# Altium schematic sheet Stepper_driver_group.SchDoc: STM32F412 CNC
size C; Author: AM; CompanyName: Expatria Technologies; DrawnBy: A.Marles; Engineer: AM; Organization: Expatria Technolgoies; Address1: PO Box 2084; Address3: Merritt, BC V1K 1B8; Address4: Canada; DocumentNumber: 8; SheetNumber: 8; SheetTotal: 27
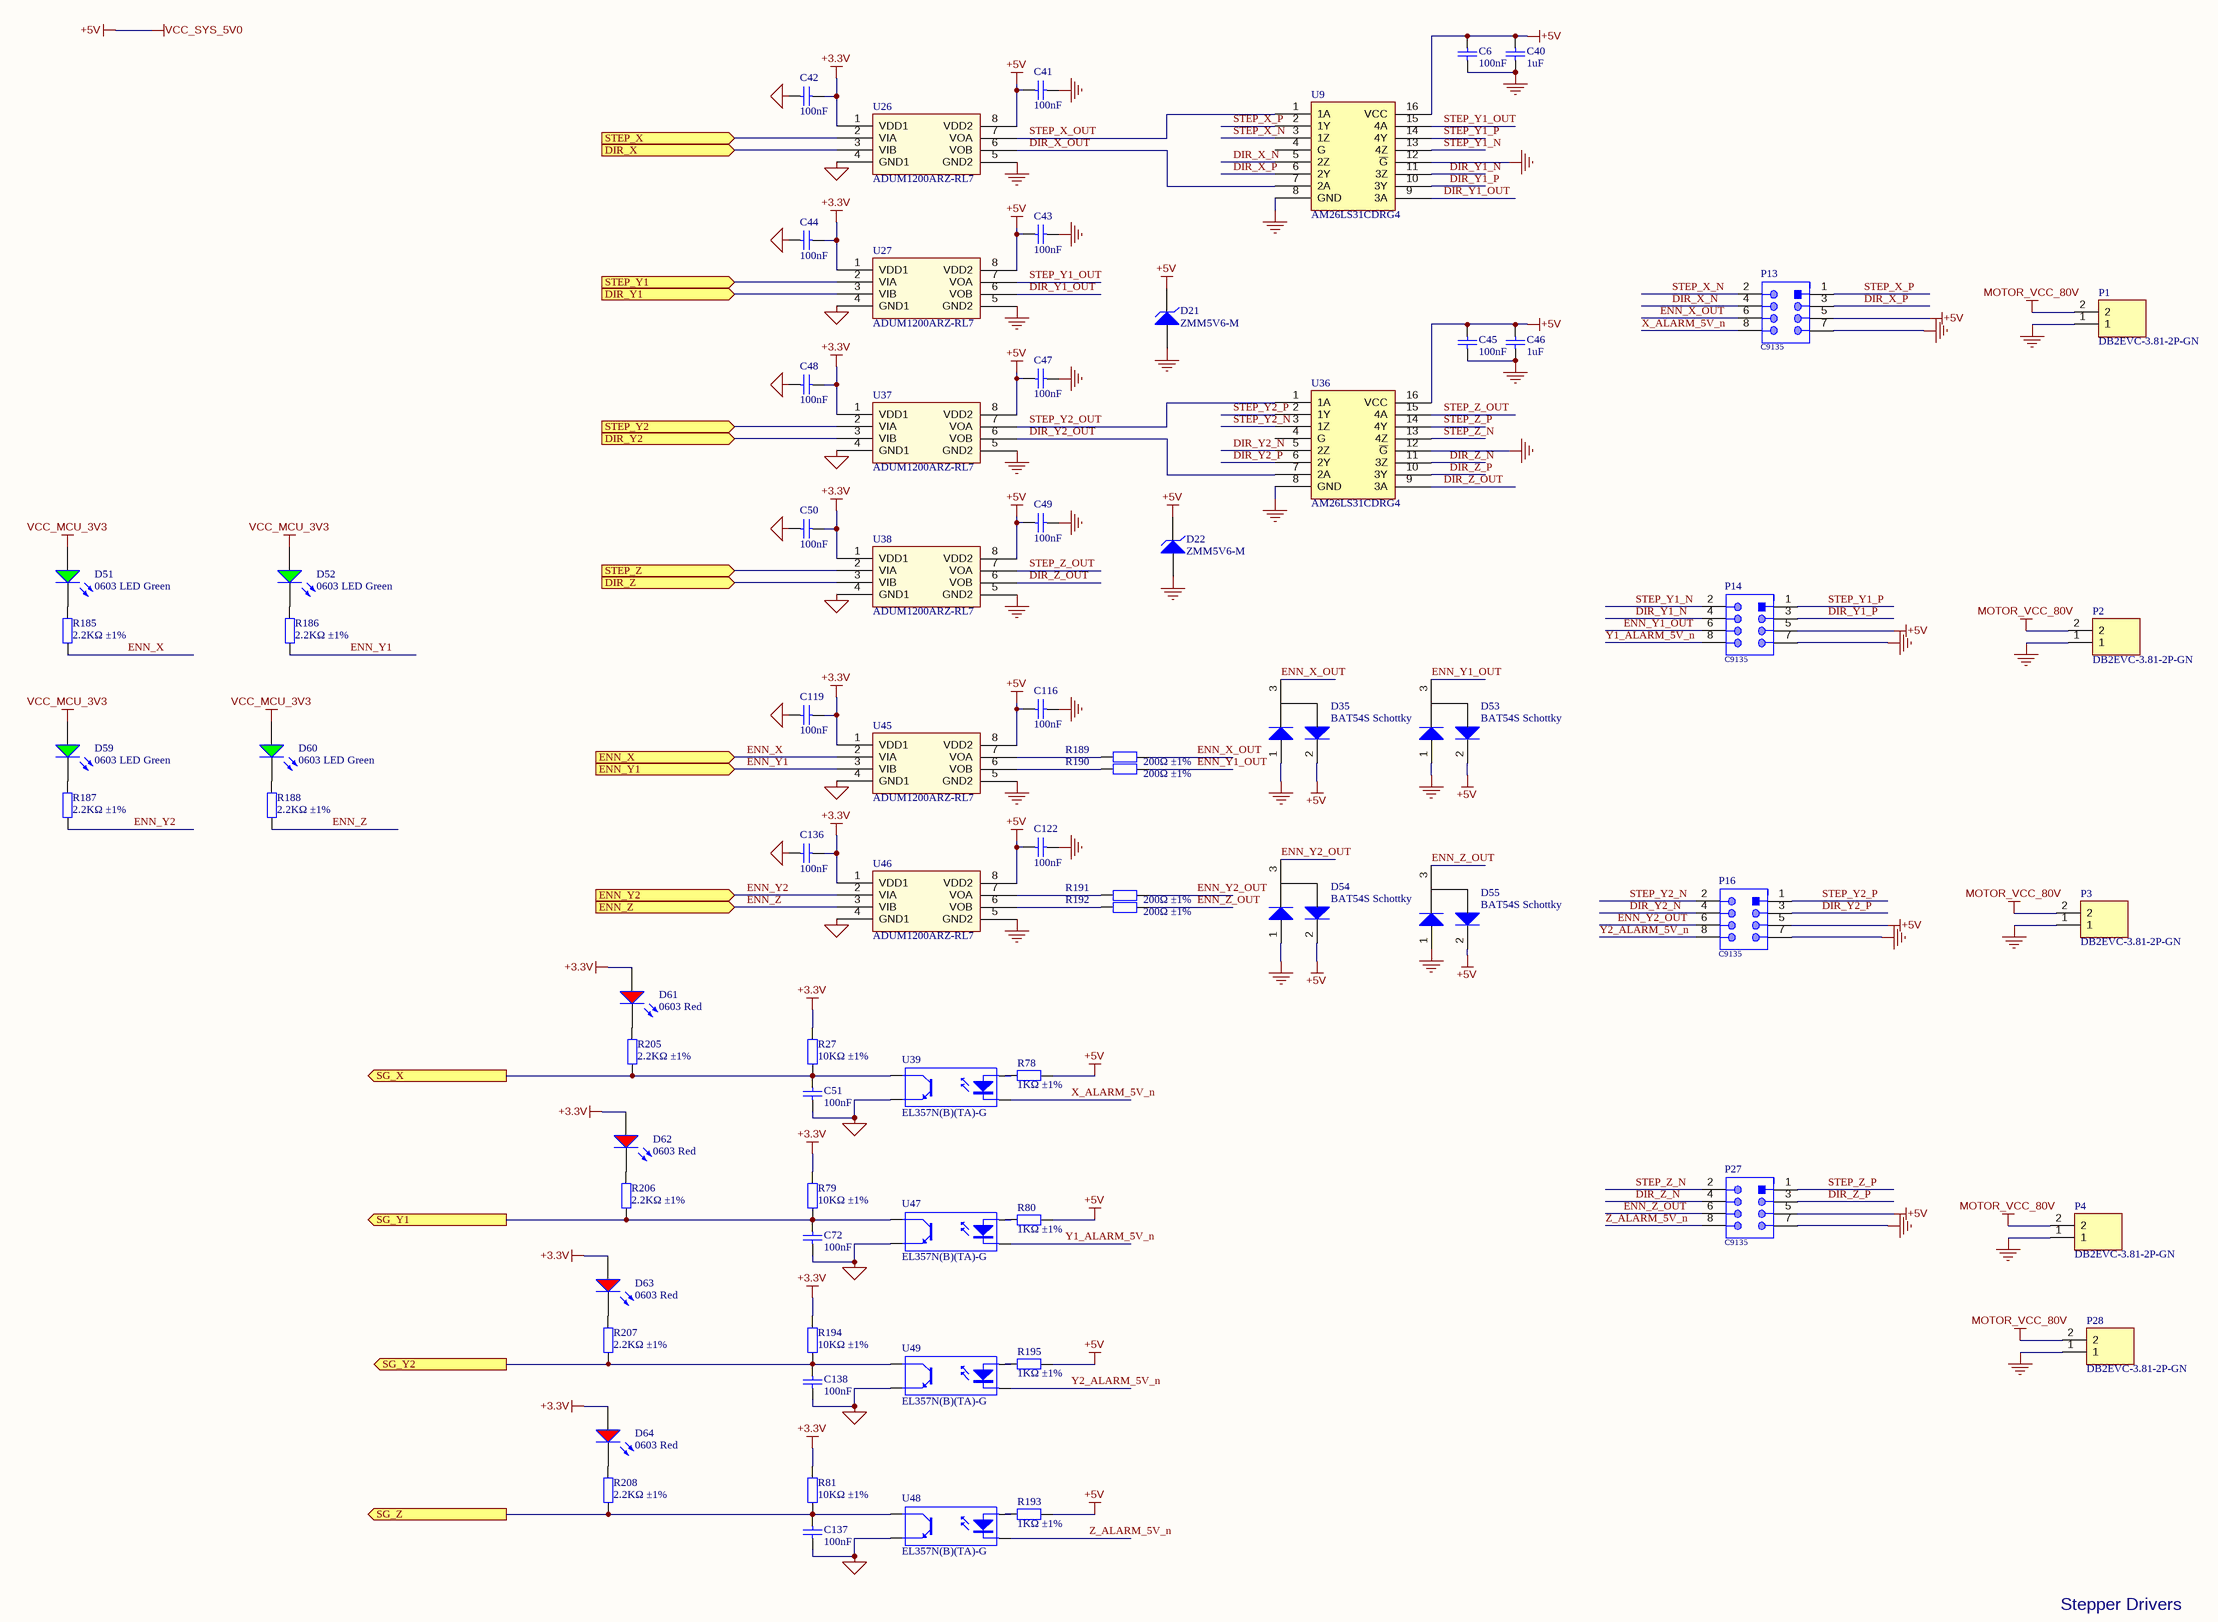
[diagram p0: Stepper_driver_group.SchDoc]

## Parts
C6  100nF  [0603_C]
C40  1uF  [0603_C]
C41  100nF  [0603_C]
C42  100nF  [0603_C]
C43  100nF  [0603_C]
C44  100nF  [0603_C]
C45  100nF  [0603_C]
C46  1uF  [0603_C]
C47  100nF  [0603_C]
C48  100nF  [0603_C]
C49  100nF  [0603_C]
C50  100nF  [0603_C]
C51  100nF  [0402_C]
C72  100nF  [0402_C]
C116  100nF  [0603_C]
C119  100nF  [0603_C]
C122  100nF  [0603_C]
C136  100nF  [0603_C]
C137  100nF  [0402_C]
C138  100nF  [0402_C]
D21  ZMM5V6-M  [LL-34]
D22  ZMM5V6-M  [LL-34]
D35  BAT54S Schottky  [SOT-23(SOT-23-3)]
D51  0603 LED Green  [0603_LED_S1 - GREEN]
D52  0603 LED Green  [0603_LED_S1 - GREEN]
D53  BAT54S Schottky  [SOT-23(SOT-23-3)]
D54  BAT54S Schottky  [SOT-23(SOT-23-3)]
D55  BAT54S Schottky  [SOT-23(SOT-23-3)]
D59  0603 LED Green  [0603_LED_S1 - GREEN]
D60  0603 LED Green  [0603_LED_S1 - GREEN]
D61  0603 Red  [0603_LED_S1]
D62  0603 Red  [0603_LED_S1]
D63  0603 Red  [0603_LED_S1]
D64  0603 Red  [0603_LED_S1]
P1  DB2EVC-3.81-2P-GN  [CONN-TH_5P-P3.81_DB2EVC-3.81-2p]
P2  DB2EVC-3.81-2P-GN  [CONN-TH_5P-P3.81_DB2EVC-3.81-2p]
P3  DB2EVC-3.81-2P-GN  [CONN-TH_5P-P3.81_DB2EVC-3.81-2p]
P4  DB2EVC-3.81-2P-GN  [CONN-TH_5P-P3.81_DB2EVC-3.81-2p]
P13  C9135  [61200821621]
P14  C9135  [61200821621]
P16  C9135  [61200821621]
P27  C9135  [61200821621]
P28  DB2EVC-3.81-2P-GN  [CONN-TH_5P-P3.81_DB2EVC-3.81-2p]
R27  10KΩ ±1%  [0402_R]
R78  1KΩ ±1%  [0603_R]
R79  10KΩ ±1%  [0402_R]
R80  1KΩ ±1%  [0603_R]
R81  10KΩ ±1%  [0402_R]
R185  2.2KΩ ±1%  [0402_R]
R186  2.2KΩ ±1%  [0402_R]
R187  2.2KΩ ±1%  [0402_R]
R188  2.2KΩ ±1%  [0402_R]
R189  200Ω ±1%  [0603_R]
R190  200Ω ±1%  [0603_R]
R191  200Ω ±1%  [0603_R]
R192  200Ω ±1%  [0603_R]
R193  1KΩ ±1%  [0603_R]
R194  10KΩ ±1%  [0402_R]
R195  1KΩ ±1%  [0603_R]
R205  2.2KΩ ±1%  [0402_R]
R206  2.2KΩ ±1%  [0402_R]
R207  2.2KΩ ±1%  [0402_R]
R208  2.2KΩ ±1%  [0402_R]
U9  AM26LS31CDRG4  [SOIC-16_150mil]
U26  ADUM1200ARZ-RL7  [SOIC-8_150mil]
U27  ADUM1200ARZ-RL7  [SOIC-8_150mil]
U36  AM26LS31CDRG4  [SOIC-16_150mil]
U37  ADUM1200ARZ-RL7  [SOIC-8_150mil]
U38  ADUM1200ARZ-RL7  [SOIC-8_150mil]
U39  EL357N(B)(TA)-G  [SOP-4_P2.54]
U45  ADUM1200ARZ-RL7  [SOIC-8_150mil]
U46  ADUM1200ARZ-RL7  [SOIC-8_150mil]
U47  EL357N(B)(TA)-G  [SOP-4_P2.54]
U48  EL357N(B)(TA)-G  [SOP-4_P2.54]
U49  EL357N(B)(TA)-G  [SOP-4_P2.54]

## Ports
DIR_X (in), DIR_Y1 (in), DIR_Y2 (in), DIR_Z (in), ENN_X (in), ENN_Y1 (in), ENN_Y2 (in), ENN_Z (in), SG_X (out), SG_Y1 (out), SG_Y2 (out), SG_Z (out), STEP_X (in), STEP_Y1 (in), STEP_Y2 (in), STEP_Z (in)

## Nets
+3.3V: C42.1 C44.1 C48.1 C50.1 C119.1 C136.1 D61.A D62.A D63.A D64.A R27.2 R79.2 R81.2 R194.2 U26.1(VDD1) U27.1(VDD1) U37.1(VDD1) U38.1(VDD1) U45.1(VDD1) U46.1(VDD1)
+5V: C6.1 C40.1 C41.2 C43.2 C45.1 C46.1 C47.2 C49.2 C116.2 C122.2 D21.2(K) D22.2(K) D35.2(A) D53.2(A) D54.2(A) D55.2(A) P13.5 P14.5 P16.5 P27.5 R78.1 R80.1 R193.1 R195.1 U9.16(VCC) U26.8(VDD2) U27.8(VDD2) U36.16(VCC) U37.8(VDD2) U38.8(VDD2) U45.8(VDD2) U46.8(VDD2)  [also labelled VCC_SYS_5V0]
GND: C6.2 C40.2 C41.1 C43.1 C45.2 C46.2 C47.1 C49.1 C116.1 C122.1 D21.1(A) D22.1(A) D35.1(A) D53.1(A) D54.1(A) D55.1(A) P1.1 P2.1 P3.1 P4.1 P13.7 P14.7 P16.7 P27.7 P28.1 U9.8(GND) U9.12(~{G}) U26.5(GND2) U27.5(GND2) U36.8(GND) U36.12(~{G}) U37.5(GND2) U38.5(GND2) U45.5(GND2) U46.5(GND2)
MCU_GND: C42.2 C44.2 C48.2 C50.2 C51.1 C72.1 C119.2 C136.2 C137.1 C138.1 U26.4(GND1) U27.4(GND1) U37.4(GND1) U38.4(GND1) U39.3(E) U45.4(GND1) U46.4(GND1) U47.3(E) U48.3(E) U49.3(E)
MOTOR_VCC_80V: P1.2 P2.2 P3.2 P4.2 P28.2
VCC_MCU_3V3: D51.A D52.A D59.A D60.A
DIR_X: U26.3(VIB) ; port DIR_X
DIR_X_N: P13.4 U9.5(2Z)
DIR_X_OUT: U9.7(2A) U26.6(VOB)
DIR_X_P: P13.3 U9.6(2Y)
DIR_Y1: U27.3(VIB) ; port DIR_Y1
DIR_Y1_N: P14.4 U9.11(3Z)
DIR_Y1_OUT: U9.9(3A) U27.6(VOB)
DIR_Y1_P: P14.3 U9.10(3Y)
DIR_Y2: U37.3(VIB) ; port DIR_Y2
DIR_Y2_N: P16.4 U36.5(2Z)
DIR_Y2_OUT: U36.7(2A) U37.6(VOB)
DIR_Y2_P: P16.3 U36.6(2Y)
DIR_Z: U38.3(VIB) ; port DIR_Z
DIR_Z_N: P27.4 U36.11(3Z)
DIR_Z_OUT: U36.9(3A) U38.6(VOB)
DIR_Z_P: P27.3 U36.10(3Y)
ENN_X: R185.1 U45.2(VIA) ; port ENN_X
ENN_X_OUT: D35.3(K) P13.6 R189.2
ENN_Y1: R186.1 U45.3(VIB) ; port ENN_Y1
ENN_Y1_OUT: D53.3(K) P14.6 R190.2
ENN_Y2: R187.1 U46.2(VIA) ; port ENN_Y2
ENN_Y2_OUT: D54.3(K) P16.6 R191.2
ENN_Z: R188.1 U46.3(VIB) ; port ENN_Z
ENN_Z_OUT: D55.3(K) P27.6 R192.2
SG_X: C51.2 R27.1 R205.1 U39.4(C) ; port SG_X
SG_Y1: C72.2 R79.1 R206.1 U47.4(C) ; port SG_Y1
SG_Y2: C138.2 R194.1 R207.1 U49.4(C) ; port SG_Y2
SG_Z: C137.2 R81.1 R208.1 U48.4(C) ; port SG_Z
STEP_X: U26.2(VIA) ; port STEP_X
STEP_X_N: P13.2 U9.3(1Z)
STEP_X_OUT: U9.1(1A) U26.7(VOA)
STEP_X_P: P13.1 U9.2(1Y)
STEP_Y1: U27.2(VIA) ; port STEP_Y1
STEP_Y1_N: P14.2 U9.13(4Z)
STEP_Y1_OUT: U9.15(4A) U27.7(VOA)
STEP_Y1_P: P14.1 U9.14(4Y)
STEP_Y2: U37.2(VIA) ; port STEP_Y2
STEP_Y2_N: P16.2 U36.3(1Z)
STEP_Y2_OUT: U36.1(1A) U37.7(VOA)
STEP_Y2_P: P16.1 U36.2(1Y)
STEP_Z: U38.2(VIA) ; port STEP_Z
STEP_Z_N: P27.2 U36.13(4Z)
STEP_Z_OUT: U36.15(4A) U38.7(VOA)
STEP_Z_P: P27.1 U36.14(4Y)
X_ALARM_5V_n: P13.8 U39.2(K)
Y1_ALARM_5V_n: P14.8 U47.2(K)
Y2_ALARM_5V_n: P16.8 U49.2(K)
Z_ALARM_5V_n: P27.8 U48.2(K)
NetD51_K: D51.K R185.2
NetD52_K: D52.K R186.2
NetD59_K: D59.K R187.2
NetD60_K: D60.K R188.2
NetD61_K: D61.K R205.2
NetD62_K: D62.K R206.2
NetD63_K: D63.K R207.2
NetD64_K: D64.K R208.2
NetR78_2: R78.2 U39.1(A)
NetR80_2: R80.2 U47.1(A)
NetR189_1: R189.1 U45.7(VOA)
NetR190_1: R190.1 U45.6(VOB)
NetR191_1: R191.1 U46.7(VOA)
NetR192_1: R192.1 U46.6(VOB)
NetR193_2: R193.2 U48.1(A)
NetR195_2: R195.2 U49.1(A)

Not connected (* = marked no-connect by the designer): U9 4(G); U36 4(G)

## Notes on the sheet
- Stepper Drivers
- Expatria Technologies
- SHEET
- PROJECT
- REV
- EMAIL: INFO@EXPATRIA.CA
- 625 Kane Valley Rd.
- Box 2084
- Merritt, BC V1K1B8
- SIZE
- ENGR
- C
- MODIFIED
- DOCUMENT
- /
- Copyright Sienci Labs 2024. This document describes Open Hardware and is licensed under the CERN-OHL-S v2. No warranty is implied or expressed.

## Library data of the parts
C6 C41-C45 C47-C50 C116 C119 C122 C136 = 0603 100nF (104) 10% 50V: Chip capacitors; Manufacturer: YAGEO; Manufacturer Part Number: CC0603KRX7R9BB104; Tolerance: 10%; Voltage: 50V; ComponentLink1Description: Supplier link; ComponentLink1URL: http://www.szlcsc.com/product/details_15331.html; Package: 0603; Supplier: LC; SuppliersPartNumber: C14663; Capacitance: 100nF
C40 C46 = 0603 1uF (105) 10% 50V: Chip capacitors; Manufacturer: Samsung Electro-Mechanics; Manufacturer Part Number: CL10A105KB8NNNC; Tolerance: 10%; Voltage: 50V; ComponentLink1Description: Supplier link; ComponentLink1URL: http://www.szlcsc.com/product/details_16531.html; Package: 0603; Supplier: LC; SuppliersPartNumber: C15849; Capacitance: 1uF
C51 C72 C137 C138 = 0402 100nF (104) 10% 16V: 16V 100nF X7R ±10% 0402 Multilayer Ceramic Capacitors MLCC - SMD/SMT ROHS; Manufacturer: Samsung Electro-Mechanics; Manufacturer Part Number: CL05B104KO5NNNC; ComponentLink1Description: Supplier link; ComponentLink1URL: http://www.szlcsc.com/product/details_1877.html; Package: 0402; Supplier: LC; SuppliersPartNumber: C1525; Capacitance: 100nF; Tolerance: 10%; Voltage: 16V
D21 D22 = LL-34 ZMM5V6-M: Single 500mW 5.2V~6V 5.6V LL-34 Zener Diodes ROHS; Manufacturer: HXY MOSFET; Manufacturer Part Number: ZMM5V6; Package: LL-34; Supplier: LC; SuppliersPartNumber: C5345993
D35 D53-D55 = SOT-23 BAT54S: 30V Dual 200mA 800mV@100mA SOT-23 Schottky Barrier Diodes (SBD) ROHS; Manufacturer: JSMSEMI; ComponentLink1Description: 供应商链接; ComponentLink1URL: http://www.szlcsc.com/product/details_2877.html; Package: SOT-23; Supplier: LC; SuppliersPartNumber: C916425; Manufacturer Part Number: BAT54S
D51 D52 D59 D60 = MHT192UGCT: 20mA -40℃~+85℃ 515nm~530nm Emerald 120° 60mW 0603 Light Emitting Diodes (LED) ROHS; Manufacturer: MEIHUA; Package: 0603; Supplier: LC; SuppliersPartNumber: C389519; Color: Green; Manufacturer Part Number: MHT192UGCT
D61-D64 = KT-0603R: -40℃~+85℃ Red 0603 Light Emitting Diodes (LED) ROHS; Manufacturer: Hubei KENTO Elec; Package: 0603; Supplier: LC; SuppliersPartNumber: C2286; Color: Red; Manufacturer Part Number: KT-0603R; Value: 0603 Red
P1-P4 P28 = DB2EVC-3.81-2P-GN: 3.81mm Green Board Edge/Receptacle-Close Push-Pull,P=3.81mm Pluggable System Terminal Block ROHS; Manufacturer: DIBO; SuppliersPartNumber: C395686; Manufacturer Part Number: DB2EVC-3.81-2P-GN; Supplier: LCSC; Value: DB2EVC-3.81-2P-GN
P13 P14 P16 P27 = 2.54-2*4P: Male Box Header WR-BHD, THT, Vertical, pitch 2.54 mm, 8 pins; Manufacturer: BOOMELE(Boom Precision Elec); Pitch: 2.54mm; SuppliersPartNumber: C9135; Manufacturer Part Number: 2.54-2*4P; Supplier: LC
R27 R79 R81 R194 = 0402 10K (1002) 1%: Chip resistor; Manufacturer: Uniroyal Elec; Manufacturer Part Number: 0402WGF1002TCE; Power: 1/16W; ComponentLink1Description: Supplier link; ComponentLink1URL: http://www.szlcsc.com/product/details_26487.html; Package: 0402; Supplier: LC; SuppliersPartNumber: C25744; Resistance: 10KΩ; Tolerance: 1%
R78 R80 R193 R195 = 0603 1K (1001) 1%: Chip resistor; Manufacturer: Uniroyal Elec; Manufacturer Part Number: 0603WAF1001T5E; Power: 1/10W; ComponentLink1Description: Supplier link; ComponentLink1URL: http://www.szlcsc.com/product/details_21904.html; Package: 0603; Supplier: LC; SuppliersPartNumber: C21190; Resistance: 1KΩ; Tolerance: 1%
R185-R188 R205-R208 = 0402 2.2K (2201) 1%: Chip resistor; Manufacturer: Uniroyal Elec; Manufacturer Part Number: 0402WGF2201TCE; Power: 1/16W; ComponentLink1Description: Supplier link; ComponentLink1URL: http://www.szlcsc.com/product/details_26622.html; Package: 0402; Supplier: LC; SuppliersPartNumber: C25879; Resistance: 2.2KΩ; Tolerance: 1%
R189-R192 = 0603 200R (2000) 1%: Chip resistor; Manufacturer: Uniroyal Elec; Manufacturer Part Number: 0603WAF2000T5E; Power: 1/10W; ComponentLink1Description: Supplier link; ComponentLink1URL: http://www.szlcsc.com/product/details_8708.html; Package: 0603; Supplier: LC; SuppliersPartNumber: C8218; Resistance: 200Ω; Tolerance: 1%
U9 U36 = AM26LS31CDRG4_[C6179]: 4/0 Driver - RS422, RS485 16-SOIC; Manufacturer: Texas Instruments; ComponentLink1Description: 供应商链接; ComponentLink1URL: http://www.szlcsc.com/product/details_6645.html; Package: SOIC-16_150mil; Supplier: LC; SuppliersPartNumber: C6179; Manufacturer Part Number: AM26LS31CDR
U26 U27 U37 U38 U45 U46 = ADUM1200ARZ-RL7: Dual Channel Isolator; Manufacturer: Analog Devices; Package: SOIC-8_150mil; Supplier: LC; SuppliersPartNumber: C15219; ComponentLink1Description: 供应商链接; ComponentLink1URL: http://www.szlcsc.com/product/details_10199.html; Manufacturer Part Number: ADUM1200ARZ-RL7
U39 U47-U49 = EL357N(B)(TA)-G_[C6649]: Optocoupler SOP-4, EL357N(B)(TA)-G, Everlight Electronics; Package: SOP-4_P2.54; Supplier: LC; SuppliersPartNumber: C6649; Manufacturer: Everlight; Manufacturer Part Number: EL357N(B)(TA)-G